# Altium schematic sheet InputFilter.SchDoc: Input Filter
size A4; Date: 08.04.2017; CheckedBy: CheckedBy; Author: Jan Petrik; CompanyName: FreeDSP; DrawnBy: Jan Petrik; Organization: FreeDSP; DocumentNumber: 3; Revision: B2; SheetNumber: 3; SheetTotal: 16; Version1: N/A; Version2: N/A; Version3: N/A; Change1description: N/A; Change2description: N/A; Change3description: N/A; Change1DrawnBy: N/A; Change2DrawnBy: N/A; Change3DrawnBy: N/A; Change1CheckedBy: N/A; Change2CheckedBy: N/A; Change3CheckedBy: N/A; PreviusVersion_Chng1: N/A; PreviusVersion_Chng2: N/A; PreviusVersion_Chng3: N/A; Variant1description: Standard assembly; Variant2description: N/A; Variant3description: N/A; Variant4description: N/A; email: jan_petrik@centrum.cz; license: CC BY-NC 4.0; DocumentName: Docname
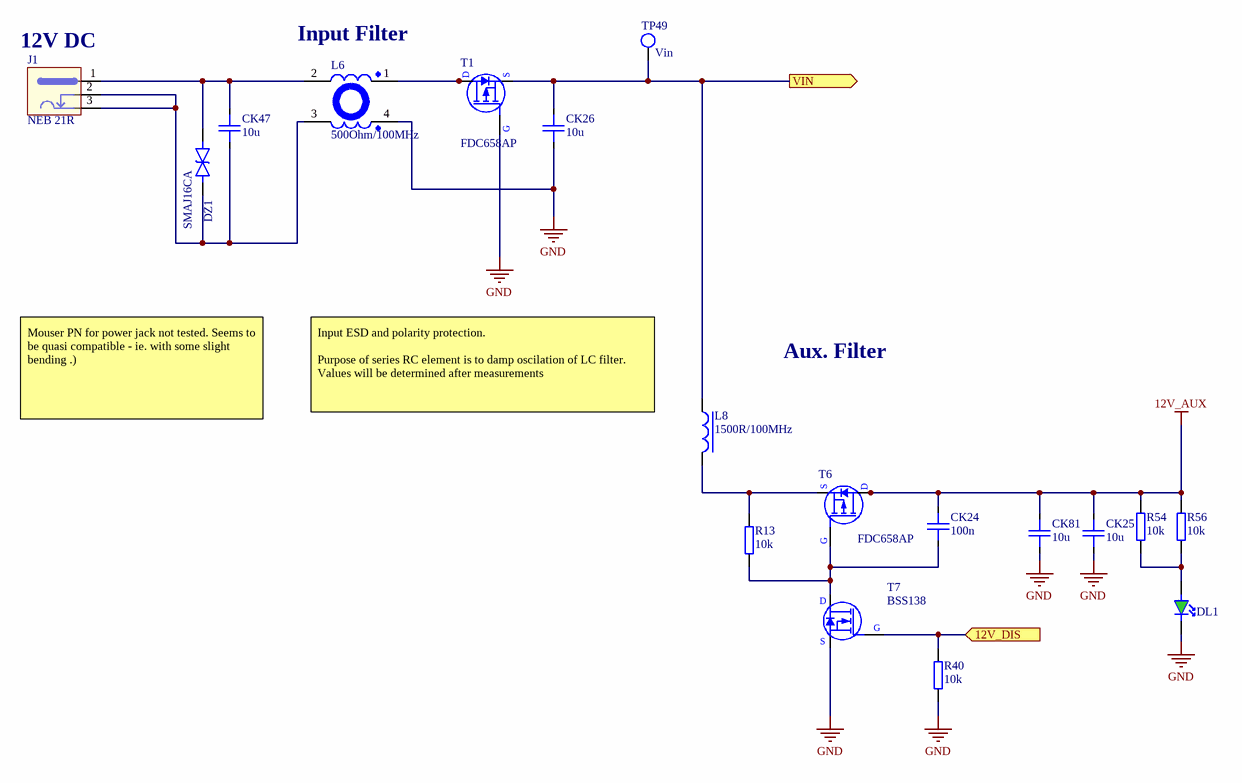
[diagram p0: InputFilter.SchDoc]

## Parts
CK24  100n  [CAPC1608X09N(SMC0603)]
CK25  10u  [CAPC3216X12N(SMC1206)]
CK26  10u  [CAPC3216X12N(SMC1206)]
CK47  10u  [CAPC3216X12N(SMC1206)]
CK81  10u  [CAPC3216X12N(SMC1206)]
DL1  GREEN  [0603diode]  (value not drawn)
DZ1  SMAJ16CA  [DIOM5127X23N(SMA)]
J1  NEB 21R  [NEB 21 R]
L6  500Ohm/100MHz  [DLW5BT]
L8  1500R/100MHz  [INDC2012X08N(SML0805)]
R13  10k  [RESC1608X06N(SMR0603)]
R40  10k  [RESC1608X06N(SMR0603)]
R54  10k  [RESC1608X06N(SMR0603)]
R56  10k  [RESC1608X06N(SMR0603)]
T1  FDC658AP  [TSOP95P280X110-6N(SuperSOT6)]
T6  FDC658AP  [TSOP95P280X110-6N(SuperSOT6)]
T7  BSS138  [SOT95P230X110-3N(SOT23)]
TP49  Vin  [TP_0.8/0.4_ROUND]  (no BOM)

## Ports
12V_DIS (in), VIN (out)

## Nets
12V_AUX: CK24.1 CK25.1 CK81.1 R54.2 R56.2 T6.1(D) T6.2(D) T6.5(D) T6.6(D)
GND: CK25.2 CK26.2 CK81.2 DL1.1(C) L6.4 R40.1 T1.3(G) T7.2(S)
12V_DIS: R40.2 T7.1(G) ; port 12V_DIS
VIN: CK26.1 L8.1 T1.4(S) TP49.1 ; port VIN
NetCK24_2: CK24.2 R13.1 T6.3(G) T7.3(D)
NetCK47_1: CK47.1 DZ1.1(AC) J1.1(Signal) L6.2
NetCK47_2: CK47.2 DZ1.2(AC) J1.2(GND) J1.3(GND) L6.3
NetDL1_2: DL1.2(A) R54.1 R56.1
NetL6_1: L6.1 T1.1(D) T1.2(D) T1.5(D) T1.6(D)
NetL8_2: L8.2 R13.2 T6.4(S)

## Notes on the sheet
- (near J1) 12V DC
- (near L6) Input Filter
- Aux. Filter
- Mouser PN for power jack not tested. Seems to be quasi compatible - ie. with some slight bending .)
- (near L8) Input ESD and polarity protection.
  Purpose of series RC element is to damp oscilation of LC filter. Values will be determined after measurements
- Designed by:
- Sheet Title:
- Board Revision:
- License:
- Email:
- www.freedsp.cc
- www.pidsp.com
- Date:
- Sheet:
- /

## Library data of the parts
CK24 = 100n-50V-0603-X7R: MLCC; Signal Integrity: Cap; Tolerance: 10%; Voltage: 50V; Value: 100n; Package: SMC2523; Simulation: Cap; Author: JP/27.03.2014; Supplier 1: Mouser; Supplier Part Number 1: 81-GRM39X104K50D
CK25 CK47 CK81 = 10u-50V-1206-X5R: MLCC; Signal Integrity: Cap; Tolerance: 10%; Voltage: 50; Mfgr. PN: GRM31CR61H106MA2L; Mfgr.: Murata; Value: 10u; Package: SMC1206; Simulation: Cap; Author: JP/10.06.2014; Supplier 1: Mouser; Supplier Part Number 1: 81-GRM31CR61H106MA2L
CK26 = 10u-50V-1206-X5R: MLCC; Signal Integrity: Cap; Voltage: 50; Tolerance: 10%; Mfgr. PN: GRM31CR61H106MA2L; Mfgr.: Murata; Value: 10u; Package: SMC1206; Simulation: Cap; Author: JP/10.06.2014; Supplier 1: Mouser; Supplier Part Number 1: 81-GRM31CR61H106MA2L
DL1 = LED_GREEN_0603: Green LED, 0603; Author: JP/31.3.2014; SMD: 1; Supplier 1: Mouser; Supplier Part Number 1: 710-150060GS75000
DZ1 = SMAJ16CA: Surface Mount TRANSZORB TVS, 16V StandOff, 400W, SMA; Tolerance & Rating: 16V 400W; Value: SMAJ16CA; Package: SMA (DO-214AC); SMD: 1; Supplier 1: Mouser; Supplier Part Number 1: 652-SMAJ16CA
J1 = Lumberg NEB 21 R: Power Jack Socket 1.95/6mm; SMD: 0; Supplier 1: Mouser; Supplier Part Number 1: 490-PJ-050AH; Supplier 2: Farnell; Supplier Part Number 2: 1217037
L6 = EL+EMICHOKE4A: CHOKE, COMMON, 4A, 500OHM, 100MHZ; SMD: 1; Author: JP 15.10.2014; Value: 500Ohm/100MHz; Supplier 1: Mouser; Supplier Part Number 1: 81-DLW5BTM501SQ2L
L8 = MMZ2012Y152B: Multilayer SMD Ferrite 1500R/100MHz; Tolerance & Rating: 25%, 100mA/0.55Ohm RDC; Value: 1500R/100MHz; Author: JP/05.06.2014; SMD: 1; Supplier 1: Mouser; Supplier Part Number 1: 810-MMZ2012Y152B; ClassName: DirectConnect
R13 R40 R54 R56 = 10k-100mW-0603-ThickFilm: Chip Resistor; Tolerance & Rating: 1%/0.1W; Signal Integrity: Res; Packare: SMR0603; Value: 10k; Simulation: Res; Author: JP/10.06.2014; SMD: 1; Supplier 1: Mouser; Supplier Part Number 1: 603-RC0603FR-0710KL; Type: Resistor
T1 T6 = FDC658AP: 30V P  -  Channel PowerTrench  MOSFET; Value: FDC658AP; SMD: 1; Supplier 1: Mouser; Supplier Part Number 1: 512-FDC658AP
T7 = ET+BSS138XX0: N-MOSFET, Logic Level, 50V/0,22A/3.5Ohm; Tolerance & Rating: 50 V/0,2 A/0,36 W; Author: JM 2.7.2014; SMD: 1; Value: BSS138; PN: BSS138; Supplier 1: Mouser; Supplier Part Number 1: 512-BSS138
TP49 = TEST_POINT_VIA: Testpoint - VIA; Value: 0.65/1.55; SMD: -; ClassName: TP